# Altium schematic sheet BAT_&_PROTECTOR.SchDoc: =DocumentName
size A4; CompanyName: "AS Manufacturing" LLC; Organization: "AS Manufacturing" LLC; Address1: 5 Sklyarenka St.; Address2: Kyiv 04073; Address3: Ukraine; Address4: https://ajax.systems/en/; DocumentNumber: 3; SheetNumber: 3; SheetTotal: 7; Template_version: 1.0.1
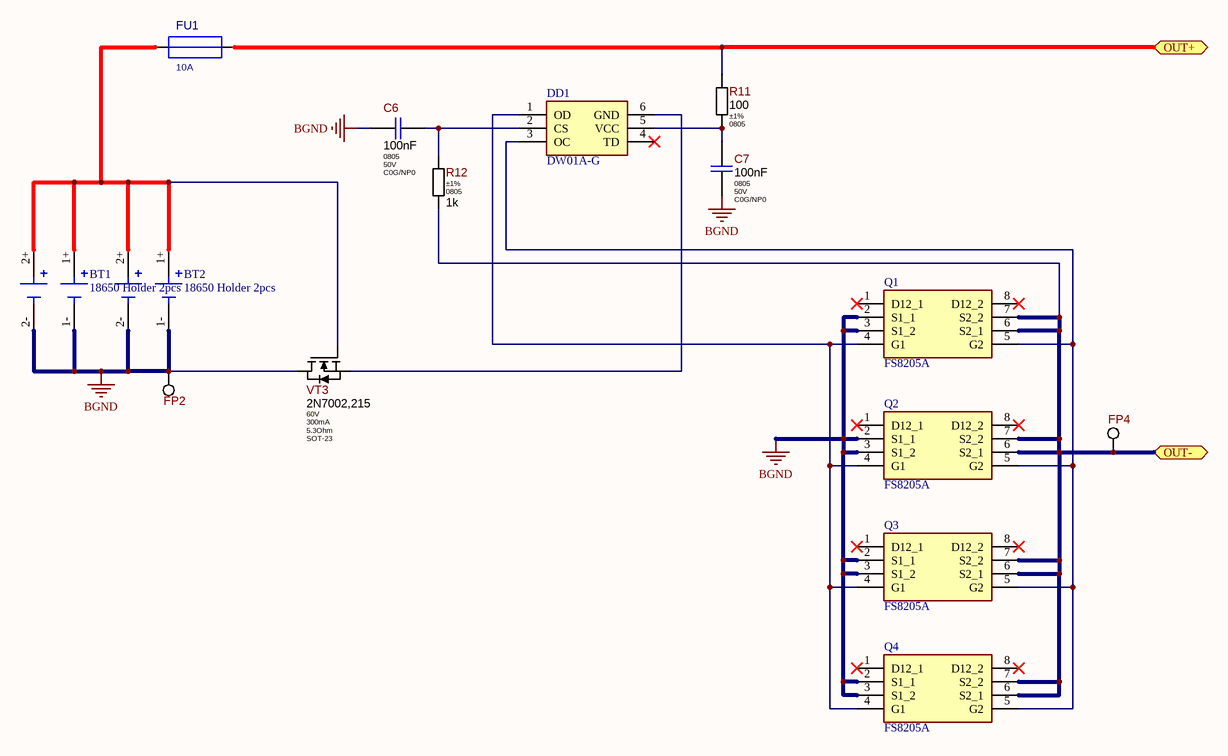
[diagram p0: BAT_&_PROTECTOR.SchDoc]

## Parts
BT1  18650 Holder 2pcs  [BAT_BK-18650-PC4]
BT2  18650 Holder 2pcs  [BAT_BK-18650-PC4]
C6  Package: 0805  Voltage: 50V  Dielectric Type: C0G/NP0  [C_CERAMIC_0805_HI]  (hidden comment: 100nF)
C7  Package: 0805  Voltage: 50V  Dielectric Type: C0G/NP0  [C_CERAMIC_0805_HI]  (hidden comment: 100nF)
DD1  DW01A-G  [DW01A-G]
FP2  PAD-1.45mm  [PAD-1.45mm]  (value not drawn)  (no BOM)
FP4  PAD-1.45mm  [PAD-1.45mm]  (value not drawn)  (no BOM)
FU1  10A  [FU_2410_6.0x2.5x2.5mm_v2]
Q1  FS8205A  [FS8205A]
Q2  FS8205A  [FS8205A]
Q3  FS8205A  [FS8205A]
Q4  FS8205A  [FS8205A]
R11  Tolerance: ±1%  Package: 0805  [R_ANY_CHIP_0805_MED]  (hidden comment: 100)
R12  Tolerance: ±1%  Package: 0805  [R_ANY_CHIP_0805_MED]  (hidden comment: 1k)
VT3  Vds: 60V  Id: 300mA  Rds: 5.3Ohm  Package: SOT-23  [SOT-23_MED]  (hidden comment: 2N7002,215)

## Ports
OUT+ (bidir), OUT- (bidir)

## Nets
BGND: BT1.1- BT1.2- BT2.1- BT2.2- C6.1 C7.2 FP2.1 Q1.2(S1_1) Q1.3(S1_2) Q2.2(S1_1) Q2.3(S1_2) Q3.2(S1_1) Q3.3(S1_2) Q4.2(S1_1) Q4.3(S1_2) VT3.3(D)
OUT+: FU1.2 R11.2 ; port OUT+
OUT-: FP4.1 Q1.6(S2_1) Q1.7(S2_2) Q2.6(S2_1) Q2.7(S2_2) Q3.6(S2_1) Q3.7(S2_2) Q4.6(S2_1) Q4.7(S2_2) R12.1 ; port OUT-
NetBT1_1+: BT1.1+ BT1.2+ BT2.1+ BT2.2+ FU1.1 VT3.1(G)
NetC6_2: C6.2 DD1.2(CS) R12.2
NetC7_1: C7.1 DD1.5(VCC) R11.1
NetDD1_1: DD1.1(OD) Q1.4(G1) Q2.4(G1) Q3.4(G1) Q4.4(G1)
NetDD1_3: DD1.3(OC) Q1.5(G2) Q2.5(G2) Q3.5(G2) Q4.5(G2)
NetDD1_6: DD1.6(GND) VT3.2(S)

Not connected (* = marked no-connect by the designer): DD1 4(TD)*; Q1 1(D12_1)* 8(D12_2)*; Q2 1(D12_1)* 8(D12_2)*; Q3 1(D12_1)* 8(D12_2)*; Q4 1(D12_1)* 8(D12_2)*

## Notes on the sheet
- Title
- Product:
- Project:
- Size:
- Date:
- Variant:
- A4
- Authors:
- Time:
- Sheet
- of
- Revision:
- @Vitech_ua
- Commit:

## Library data of the parts
BT1 BT2 = 18650 Holder 2pcs: Battery Holder (Open) 18650 2 Cell PC Pin; MP: BK-18650-PC4; Price: None; Value: *; Package: None; Availability: Unavailable
C6 C7 = CERAMIC_0805: Part Number: **; Manufacturer: Hitano; Component Status: Released; Tolerance: ±5%; Replacement: NONE; GUID_1C: 32087c8a-96b8-11ea-ab61-0050569f2651; Part Type: Ceramic / C0G(NP0) / 0402; Component Type: SMD; Temperature Range: -55°C ~ 125°C; ComponentLink1URL: \\altiumdb.ajax.local\files\Datasheet\Capacitor\Hitano-MLCC.pdf; Price: 0; ComponentLink1Description: Datasheet; Value: 100nF
DD1 = DW01A-G: One Cell Lithium-ion/Polymer Battery Protection IC; Component Type: SMD
FP2 FP4 = PAD-1.45mm: 1.45mm Pad for Plug-In or Receptacle; Ajax_1C_PN: NONE; Ajax_1С_Status: RND Only; Component Status: Released; Part Number: PAD-1.45mm; Component Type: PTH; Manufacturer: NONE; Part Type: Pad; Temperature Range: NONE; ComponentLink1URL: NONE; Replacement: NONE; Price: NONE; ComponentLink1Description: Datasheet
FU1 = FUSE_SMD_2410_v2: Medium Blow Fuse 65V 15A SMD 2410; Manufacturer: BEL FUSE; Part Number: 0679L9100-01; Power Rating: 10A (Hold); Package: 2410; Value: 10A; Type: Запобіжник; Mount: SMT; Min Operating Temperature: -40°C; Max Operating Temperature: 85°C; Number of Pins: 2; Name: *
Q1-Q4 = FS8205A: Dual N-Channel Enahncement Mode Power MOSFET; Datasheet: https://www.ic-fortune.com/upload/Download/FS8205A-DS-12_EN.pdf; ComponentLink1Description: Data; ComponentLink1URL: https://www.ic-fortune.com/upload/Download/FS8205A-DS-12_EN.pdf
R11 = RC0805FR-07120RL: 100 Ohms ±1%, 1/8W 0805 Thick Film Resistor; Manufacturer: Yageo; Ajax_1C_ID: 14156; Ajax_1C_PN: 120R 1% 0805 Resistors SMD RoHS; Ajax_1С_Status: Mass Production; Power Rating: 0.125W; Voltage: 150V; Component Status: Released; Temperature Stability: ±100ppm/°C; Replacement: NONE; GUID_1C: b31bb40e-dc54-11e8-ab4a-0050569f2651; Value: 100; Part Number: RC0805FR-07120RL; Component Type: SMD; Part Type: Thick Film; Temperature Range: -55°C ~ 155°C; ComponentLink1URL: https://eu.mouser.com/datasheet/2/447/PYu_RC_Group_51_RoHS_L_10-1664068.pdf; Price: 0,0014; ComponentLink1Description: Datasheet
R12 = RC0805FR-071KL: 1 kOhms ±1%, 1/8W 0805 Thick Film Resistor; Manufacturer: Yageo; Ajax_1C_ID: 8520; Ajax_1C_PN: 1k 1% 0805 Resistors SMD RoHS; Ajax_1С_Status: Mass Production; Power Rating: 0.125W; Voltage: 150V; Component Status: Released; Temperature Stability: ±100ppm/°C; Replacement: NONE; GUID_1C: 0c53a8ec-2890-11e6-81ae-d8cb8a9acc66; Value: 1k; Part Number: RC0805FR-071KL; Component Type: SMD; Part Type: Thick Film; Temperature Range: -55°C ~ 155°C; ComponentLink1URL: https://eu.mouser.com/datasheet/2/447/PYu_RC_Group_51_RoHS_L_10-1664068.pdf; Supplier 1: Digi-Key; Supplier Part Number 1: 311-1.00KCRTR-ND; Price: 0,0014; ComponentLink1Description: Datasheet
VT3 = 2N7002,215: 60V, 300mA max N-Channel Trench MOSFET, 3.8Ohm @ Vgs = 4.5V; Manufacturer: Nexperia USA; Ajax_1C_ID: 8875; Ajax_1C_PN: 2N7002.215 , NXP полевой транзистор; Ajax_1С_Status: Mass Production; Component Status: Released; Standard Lead Time: 4 Weeks; Replacement: NONE; GUID_1C: 4d2e7416-6b97-11e6-8203-d8cb8a9acc66; Part Number: 2N7002,215; Part Type: N-Channel; Component Type: SMD; Temperature Range: -65°C ~ 150°C; ComponentLink1URL: https://assets.nexperia.com/documents/data-sheet/2N7002.pdf; Supplier 1: Digi-Key; Supplier Part Number 1: 1727-2764-2-ND; Price: 0.0202; ComponentLink1Description: Datasheet